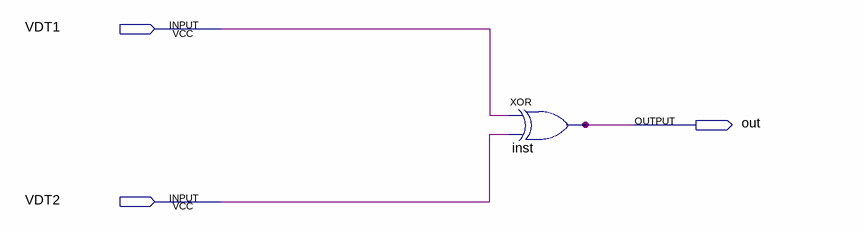
[diagram p0: schematic sheet]
// Quartus schematic assignment6.bdf as structural Verilog: 1 symbols, 3 pins
module assignment6 (
  input  VDT1,
  input  VDT2,
  output out
);

  xor inst (out, VDT1, VDT2);
endmodule
